# Altium schematic sheet 音源选择电路.SchDoc
size A3
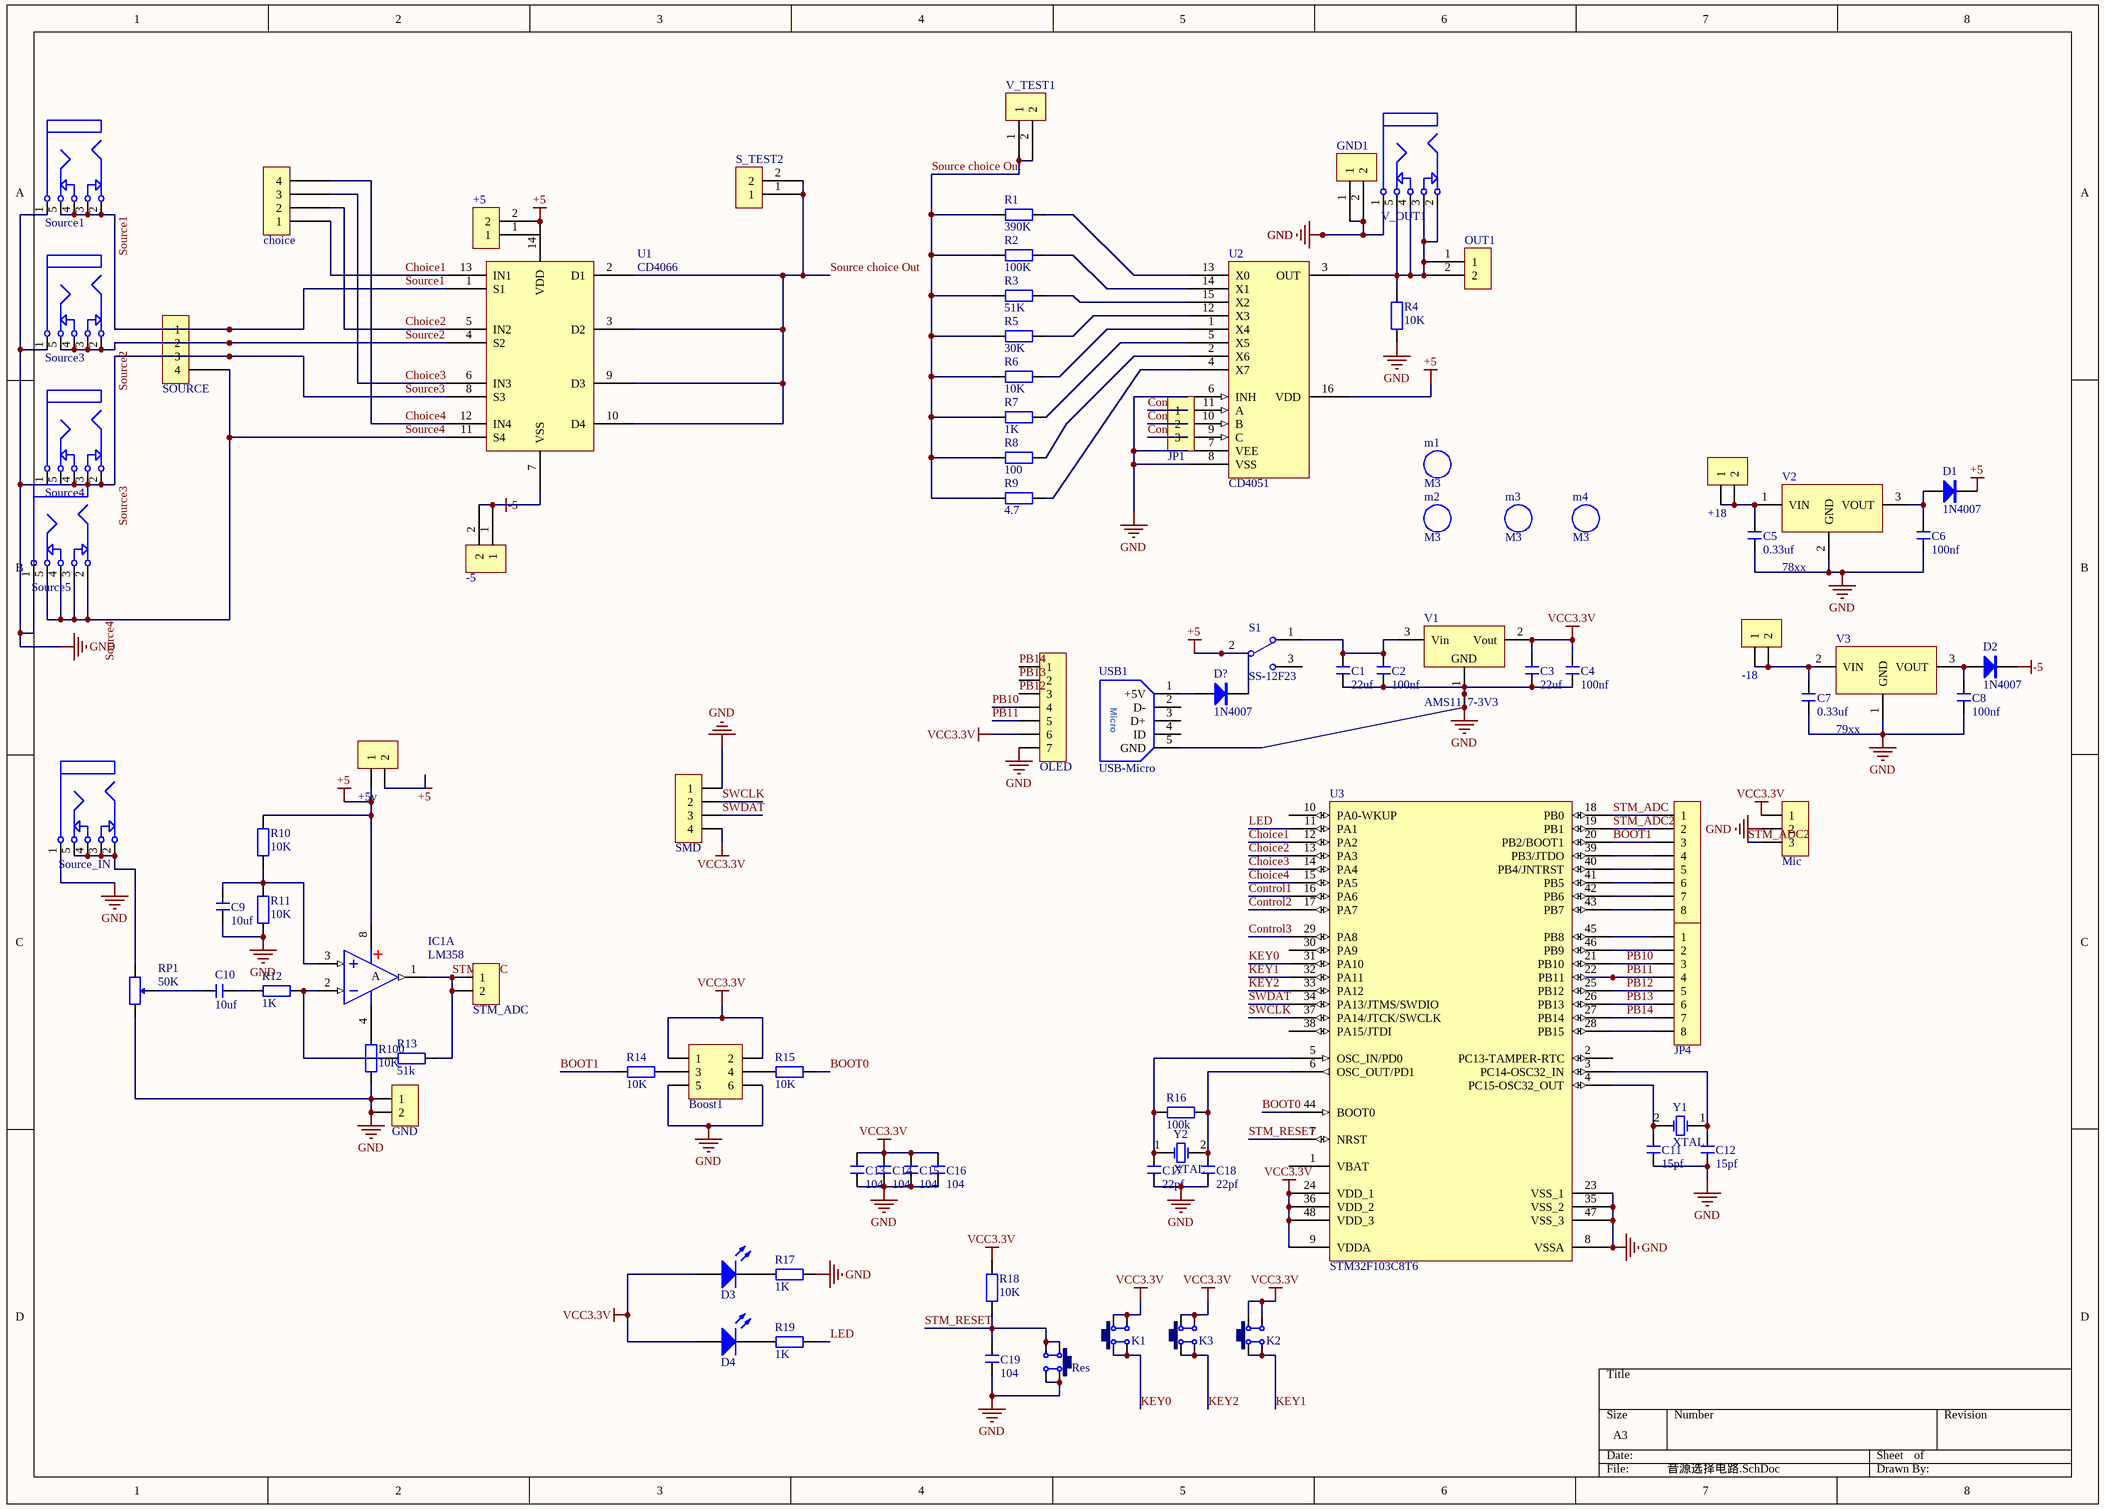
[diagram p0: 音源选择电路.SchDoc]

## Parts
+5  (no value)  [HDR2.54-LI-2P]
+5v  HDR-1X2  [HDR2.54-LI-2P]  (value not drawn)
+18  HDR-1X2  [HDR2.54-LI-2P]  (value not drawn)
-5  (no value)  [HDR2.54-LI-2P]
-18  HDR-1X2  [HDR2.54-LI-2P]  (value not drawn)
Boost1  Header3X2  [HDR2.54-LI-2x3P]  (value not drawn)
C1  22uf  [C 0805_L]
C2  100nf  [C 0805_L]
C3  22uf  [C 0805_L]
C4  100nf  [C 0805_L]
C5  0.33uf  [C 0805_L]
C6  100nf  [C 0805_L]
C7  0.33uf  [C 0805_L]
C8  100nf  [C 0805_L]
C9  10uf  [C 0805_L]
C10  10uf  [C 0805_L]
C11  15pf  [C 0805_L]
C12  15pf  [C 0805_L]
C13  104  [C 0805_L]
C14  104  [C 0805_L]
C15  104  [C 0805_L]
C16  104  [C 0805_L]
C17  22pf  [C 0805_L]
C18  22pf  [C 0805_L]
C19  104  [C 0805_L]
choice1  choice  [HDR2.54-LI-4P]
D1  1N4007  [SOD-123]
D2  1N4007  [SOD-123]
D3  LED  [LED 0603B]  (value not drawn)
D4  LED  [LED 0603B]  (value not drawn)
D?  1N4007  [SOD-123]
GND  HDR-1X2  [HDR2.54-LI-2P]  (value not drawn)
GND1  (no value)  [HDR2.54-LI-2P]
IC1  LM358  [SOP8_N]  (part A of 2)
JP1  HDR-1X3  [HDR2.54-LI-3P]  (value not drawn)
JP3  HDR-1X8  [HDR2.54-LI-8P]  (value not drawn)
JP4  HDR-1X8  [HDR2.54-LI-8P]  (value not drawn)
K1  6x6x5  [TSW DIP-6*6*6]  (value not drawn)
K2  6x6x5  [TSW DIP-6*6*6]  (value not drawn)
K3  6x6x5  [TSW DIP-6*6*6]  (value not drawn)
m1  M3  [M3 125X200]
m2  M3  [M3 125X200]
m3  M3  [M3 125X200]
m4  M3  [M3 125X200]
Mic  HDR-1X3  [HDR2.54-LI-3P]  (value not drawn)
OLED  HDR-1X7  [HDR-1X7]  (value not drawn)
OUT1  (no value)  [HDR2.54-LI-2P]
R1  390K  [R 0805_M]
R2  100K  [R 0805_M]
R3  51K  [R 0805_M]
R4  10K  [R 0805_M]
R5  30K  [R 0805_M]
R6  10K  [R 0805_M]
R7  1K  [R 0805_M]
R8  100  [R 0805_M]
R9  4.7  [R 0805_M]
R10  10K  [R 0805_L]
R11  10K  [R 0805_L]
R12  1K  [R 0805_L]
R13  51k  [R 0805_L]
R14  10K  [R 0805_L]
R15  10K  [R 0805_L]
R16  100k  [R 0805_L]
R17  1K  [R 0805_L]
R18  10K  [R 0805_L]
R19  1K  [R 0805_L]
R100  10K  [R 0805_L]
Res  6x6x5  [TSW DIP-6*6*6]  (value not drawn)
RP1  50K  [3296W]
S1  SS-12F23  [SS-12F23]
S_TEST2  (no value)  [HDR2.54-LI-2P]
SMD  HDR-1X4  [HDR2.54-LI-4P]  (value not drawn)
Source1  3F07_BK  [3F07_PK]  (value not drawn)
source2  SOURCE  [HDR2.54-LI-4P]
Source3  3F07_BK  [3F07_PK]  (value not drawn)
Source4  3F07_BK  [3F07_PK]  (value not drawn)
Source5  3F07_BK  [3F07_PK]  (value not drawn)
Source_IN  3F07_BK  [3F07_PK]  (value not drawn)
STM_ADC  HDR-1X2  [HDR2.54-LI-2P]  (value not drawn)
U1  CD4066  [SOP14]
U2  CD4051  [SOP16]
U3  STM32F103C8T6  [LQFP48 7X7_N]
USB1  USB-Micro  [USB-MICRO_A]
V1  AMS1117-3V3  [SOT223_L]
V2  78xx  [TO220_3]
V3  79xx  [TO220_3]
V_OUT1  3F07_BK  [3F07_PK]  (value not drawn)
V_TEST1  (no value)  [HDR2.54-LI-2P]
Y1  XTAL  [XTAL]
Y2  XTAL  [XTAL]

## Nets
+5: +5.2 +5v.1 +5v.2 D1.2(K) D?.2(K) IC1.8(V+) R10.2 S1.2 U1.14(VDD) U2.16(VDD)
-5: -5.1 -5.2 D2.2(K) U1.7(VSS)
GND: Boost1.5 Boost1.6 C1.1 C2.1 C3.1 C4.1 C5.1 C6.1 C7.1 C8.1 C9.1 C11.2 C12.2 C13.1 C14.1 C15.1 C16.1 C17.1 C18.1 C19.1 GND.1 GND.2 GND1.1 GND1.2 Mic.2 OLED.7 R4.1 R11.1 R17.2 R100.1 Res.2 Res.3 RP1.3 SMD.1 Source1.1 Source3.1 Source4.1 Source5.1 Source_IN.1 U2.6(INH) U2.7(VEE) U2.8(VSS) U3.8(VSSA) U3.23(VSS_1) U3.35(VSS_2) U3.47(VSS_3) USB1.5(GND) V1.1(GND) V2.2(GND) V3.1(GND) V_OUT1.1
VCC3.3V: Boost1.1 Boost1.2 C3.2 C4.2 C13.2 C14.2 C15.2 C16.2 D3.1(A) D4.1(A) K1.2 K1.3 K2.2 K2.3 K3.2 K3.3 Mic.1 OLED.6 R18.1 SMD.4 U3.9(VDDA) U3.24(VDD_1) U3.36(VDD_2) U3.48(VDD_3) V1.2(Vout)
BOOT0: R15.1 U3.44(BOOT0)
BOOT1: JP3.3 R14.1 U3.20(PB2/BOOT1)
Choice1: choice1.1 U1.13(IN1) U3.12(PA2)
Choice2: choice1.2 U1.5(IN2) U3.13(PA3)
Choice3: choice1.3 U1.6(IN3) U3.14(PA4)
Choice4: choice1.4 U1.12(IN4) U3.15(PA5)
Control1: JP1.1 U2.11(A) U3.16(PA6)
Control2: JP1.2 U2.10(B) U3.17(PA7)
Control3: JP1.3 U2.9(C) U3.29(PA8)
KEY0: K1.1 K1.4 U3.31(PA10)
KEY1: K2.1 K2.4 U3.32(PA11)
KEY2: K3.1 K3.4 U3.33(PA12)
LED: R19.2 U3.11(PA1)
PB10: JP4.3 OLED.4 U3.21(PB10)
PB11: JP4.4 OLED.5 U3.22(PB11)
PB12: JP4.5 OLED.3 U3.25(PB12)
PB13: JP4.6 OLED.2 U3.26(PB13)
PB14: JP4.7 OLED.1 U3.27(PB14)
Source1: Source1.2 Source1.3 Source1.4 Source1.5 source2.1 U1.1(S1)
Source2: source2.2 Source3.2 Source3.3 Source3.4 Source3.5 U1.4(S2)
Source3: source2.3 Source4.2 Source4.3 Source4.4 Source4.5 U1.8(S3)
Source4: source2.4 Source5.2 Source5.3 Source5.4 Source5.5 U1.11(S4)
Source choice Out: R1.1 R2.1 R3.1 R5.1 R6.1 R7.1 R8.1 R9.1 S_TEST2.1 S_TEST2.2 U1.2(D1) U1.3(D2) U1.9(D3) U1.10(D4) V_TEST1.1 V_TEST1.2
STM_ADC: IC1.1(OUT) JP3.1 R13.2 STM_ADC.1 STM_ADC.2 U3.18(PB0)
STM_ADC2: JP3.2 Mic.3 U3.19(PB1)
STM_RESET: C19.2 R18.2 Res.1 Res.4 U3.7(NRST)
SWCLK: SMD.2 U3.37(PA14/JTCK/SWCLK)
SWDAT: SMD.3 U3.34(PA13/JTMS/SWDIO)
Net+18_1: +18.1 +18.2 C5.2 V2.1(VIN)
Net-18_1: -18.1 -18.2 C7.2 V3.2(VIN)
NetBoost1_3: Boost1.3 R14.2
NetBoost1_4: Boost1.4 R15.2
NetC1_2: C1.2 C2.2 S1.1 V1.3(Vin)
NetC6_2: C6.2 D1.1(A) V2.3(VOUT)
NetC8_2: C8.2 D2.1(A) V3.3(VOUT)
NetC9_2: C9.2 IC1.3(IN+) R10.1 R11.2
NetC10_1: C10.1 RP1.2
NetC10_2: C10.2 R12.1
NetC11_1: C11.1 U3.4(PC15-OSC32_OUT) Y1.2
NetC12_1: C12.1 U3.3(PC14-OSC32_IN) Y1.1
NetC17_2: C17.2 R16.1 U3.5(OSC_IN/PD0) Y2.1
NetC18_2: C18.2 R16.2 U3.6(OSC_OUT/PD1) Y2.2
NetD3_2: D3.2(K) R17.1
NetD4_2: D4.2(K) R19.1
NetD?_1: D?.1(A) USB1.1(+5V)
NetIC1_2: IC1.2(IN-) R12.2 R13.1
NetIC1_4: IC1.4(V-) R100.2
NetJP3_4: JP3.4 U3.39(PB3/JTDO)
NetJP3_5: JP3.5 U3.40(PB4/JNTRST)
NetJP3_6: JP3.6 U3.41(PB5)
NetJP3_7: JP3.7 U3.42(PB6)
NetJP3_8: JP3.8 U3.43(PB7)
NetJP4_1: JP4.1 U3.45(PB8)
NetJP4_2: JP4.2 U3.46(PB9)
NetJP4_8: JP4.8 U3.28(PB15)
NetOUT1_1: OUT1.1 OUT1.2 R4.2 U2.3(OUT) V_OUT1.2 V_OUT1.3 V_OUT1.4 V_OUT1.5
NetR1_2: R1.2 U2.13(X0)
NetR2_2: R2.2 U2.14(X1)
NetR3_2: R3.2 U2.15(X2)
NetR5_2: R5.2 U2.12(X3)
NetR6_2: R6.2 U2.1(X4)
NetR7_2: R7.2 U2.5(X5)
NetR8_2: R8.2 U2.2(X6)
NetR9_2: R9.2 U2.4(X7)
NetRP1_1: RP1.1 Source_IN.2 Source_IN.3 Source_IN.4 Source_IN.5

Not connected (* = marked no-connect by the designer): +5 1; S1 3; U3 1(VBAT) 2(PC13-TAMPER-RTC) 10(PA0-WKUP) 30(PA9) 38(PA15/JTDI); USB1 2(D-) 3(D+) 4(ID)

## Notes on the sheet
- (in symbol LM358, part A) A
- (in symbol USB-Micro) Micro

## Library data of the parts
+5 -5 GND1 OUT1 S_TEST2 V_TEST1 = Component_1
+5v +18 -18 GND STM_ADC = Header 2: 2P接插件; 版权归属: 封装库来自淘宝 ID：黄晶宝石; BOM名称: 2P接插件; 联系售后: https://shop463601444.taobao.com
Boost1 = Header 3X2: 3*2P接插件; 版权归属: 封装库来自淘宝 ID：黄晶宝石; BOM名称: 3*2P接插件; 学习资源: https://shop463601444.taobao.com
C1-C19 = C: 贴片电容; BOM名称: 无极性贴片电容; 淘宝ID: 封装库来自淘宝 ID：黄晶宝石; 联系售后，技术支持: https://shop463601444.taobao.com; 唯一出售店铺网址: https://shop463601444.taobao.com
choice1 = SOURCE
D1 D2 D? = 1N4007: 整流二极管; 淘宝ID: 封装库来自淘宝 ID：黄晶宝石; 封装库来自淘宝卖家 ID：黄晶宝石: 其他店铺购入均为盗版，不享受售后技术支持服务，请立即申请退款; BOM名称: 整流二极管; 联系售后，技术支持: https://shop463601444.taobao.com
D3 D4 = LED: 发光二极管; 技术支持，联系售后: https://shop463601444.taobao.com
IC1 = LM358: 双路运放; 版权归属: 源创客; BOM名称: 双路运放; 封装库来自淘宝 ID：黄晶宝石: https://shop463601444.taobao.com
JP1 = Header 3: 3P接插件; 优秀评价可免费更新封装库: 联系淘宝ID：黄晶宝石，获取更新版封装库; 卖家免费技术支持，联系售后: 唯一出售店铺网址https://shop463601444.taobao.com; 封装库来自淘宝卖家 ID：黄晶宝石: 其他店铺购入均为盗版，请立即申请退款
JP3 JP4 = Header 8: 8P接插件; 版权归属: 封装库来自淘宝 ID：黄晶宝石; BOM名称: 8P接插件; 学习资源: https://shop463601444.taobao.com
K1-K3 Res = TSW DIP-6x6: 直插6x6轻触开关; 免费技术支持，联系售后: 唯一出售店铺网址https://shop463601444.taobao.com; 封装库来自淘宝卖家 ID：黄晶宝石: 其他店铺购入均为盗版假冒封装库，请立即申请退款，本店3~10元现金奖励; BOM名称: 直插6x6轻触开关
m1-m4 = M3: 铜柱孔; 封装库来自淘宝卖家 ID：黄晶宝石: 其他店铺购入均为盗版，请立即申请退款，本店提供现金奖励; 免费技术支持，联系售后: 唯一出售店铺网址https://shop463601444.taobao.com; BOM名称: 铜柱孔
Mic = Header 3: 3P接插件; 版权归属: 封装库来自淘宝 ID：黄晶宝石; BOM名称: 3P接插件; 学习资源: https://shop463601444.taobao.com
OLED = Header 7: 7P接插件; 版权归属: 黎明电子style; BOM名称: 7P接插件; 学习资源: https://lmdzstyle.taobao.com/
R1-R9 = R-S: 色环电阻; 封装库来自淘宝卖家 ID：黄晶宝石: 其他店铺购入均为盗版假冒封装库; 联系卖家，免费查找封装: 唯一出售店铺网址https://shop463601444.taobao.com; BOM名称: 色环电阻
R10-R19 R100 = R: 贴片电阻; 版权归属: 来自淘宝 ID：黄晶宝石; 封装库来自淘宝卖家 ID：黄晶宝石: 其他店铺购入均为盗版，不享受售后技术支持服务，请立即申请退款; BOM名称: 贴片电阻; 联系售后: https://shop463601444.taobao.com
RP1 = RP: 单联电位器; BOM名称: 插件电位器; 版权归属: 封装库来自淘宝 ID：黄晶宝石; 联系售后: https://shop463601444.taobao.com
S1 = SSW-1P: 1路波动开关; BOM名称: 波动开关; 版权归属: 黎明电子style; 学习资源: https://lmdzstyle.taobao.com/
SMD = Header 4: 4P接插件; 版权归属: 封装库来自淘宝 ID：黄晶宝石; BOM名称: 4P接插件; 学习资源: https://shop463601444.taobao.com
Source1 Source3-Source5 Source_IN V_OUT1 = 3F07: 3.5mm耳机插座; BOM名称: 耳机插座; 封装库来自淘宝卖家 ID：黄晶宝石: 其他店铺购入均为盗版，不享受售后技术支持服务，请立即申请退款; 卖家免费查找封装，联系售后: 唯一出售店铺网址https://shop463601444.taobao.com
source2 = SOURCE: a
U3 = STM32F103C8T6: Flaah:64/RAM:20/IO:36; BOM名称: 32位STM单片机; 版权归属: 源创客; 学习资源: www.ooocke.com
USB1 = USB-Micro: BOM名称: USBMicro
V1 = AMS1117: 三端稳压芯片; BOM名称: 稳压芯片; 淘宝ID: 封装库来自淘宝 ID：黄晶宝石; 欢迎光临淘宝店铺: https://shop463601444.taobao.com
V2 = 78xx: 线性稳压芯片; 版权归属: 源创客; BOM名称: 线性稳压芯片; 学习资源: www.ooocke.com
V3 = 79xx: 线性稳压芯片; 版权归属: 源创客; BOM名称: 线性稳压芯片; 学习资源: www.ooocke.com